# EAGLE design Dragon_LowerCase_v1 (EAGLE 7.7.0)
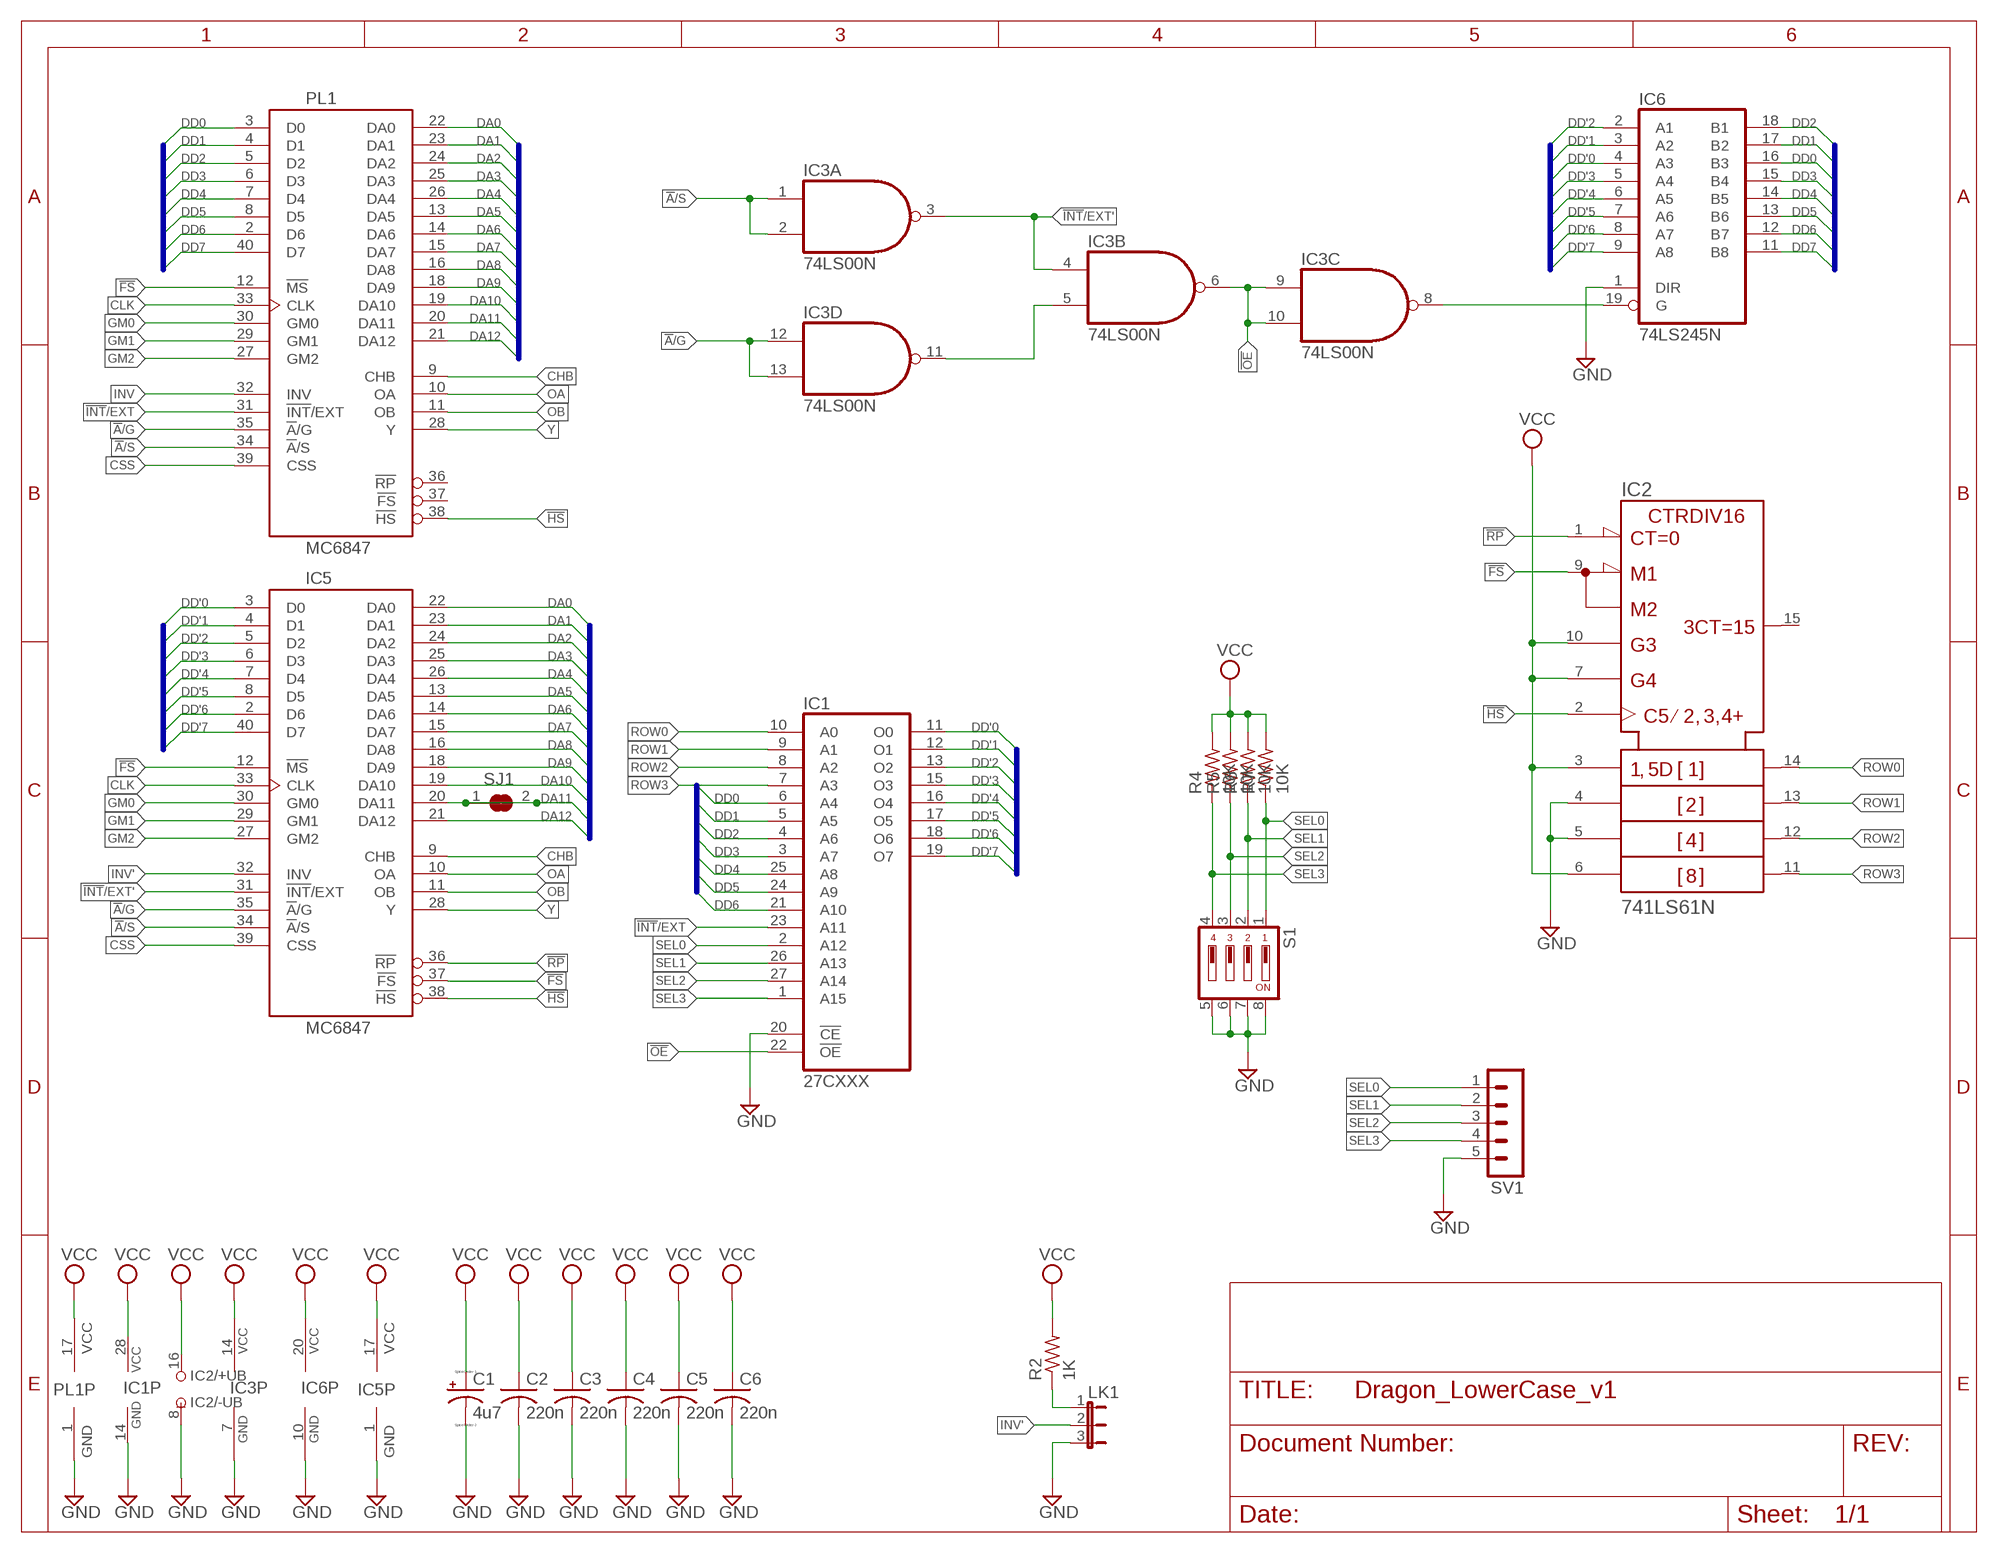
[diagram p0: schematic, sheet 1]

## Parts
C1  4u7  CPOL-USE2.5-5  [E2,5-5]
C2  220n  C-US025-025X050  [C025-025X050]
C3  220n  C-US025-025X050  [C025-025X050]
C4  220n  C-US025-025X050  [C025-025X050]
C5  220n  C-US050-025X075  [C050-025X075]
C6  220n  C-US025-025X050  [C025-025X050]
IC1  27CXXX  27512  [DIL28]
IC2  741LS61N  74161N  [DIL16]
IC3  74LS00N  [DIL14-RP]
IC5  MC6847  [DIL40]
IC6  74LS245N  [DIL20-RP]
LK1  JP2E  [JP2]
PL1  MC6847  [DIL40]
R2  1K  R-US_0204/2V  [0204V]
R4  10K  R-US_0204/2V  [0204V]
R5  10K  R-US_0204/2V  [0204V]
R6  10K  R-US_0204/2V  [0204V]
R7  10K  R-US_0204/2V  [0204V]
S1  DS04  [DS-04]
SJ1  SJ  [SJ]
SV1  MA05-1  [MA05-1]

## Nets
!A!/G: IC3.12(D:I0) IC3.13(D:I1) IC5.35(!A!/G) PL1.35(!A!/G)
!A!/S: IC3.1(A:I0) IC3.2(A:I1) IC5.34(!A!/S) PL1.34(!A!/S)
!FS: IC2.9(!LOAD) IC5.12(!MS) IC5.37(!FS) PL1.12(!MS)
!HS: IC2.2(CLK) IC5.38(!HS) PL1.38(!HS)
!INT!/EXT: IC1.23(A11) PL1.31(!INT!/EXT)
!INT!/EXT': IC3.3(A:O) IC3.4(B:I0) IC5.31(!INT!/EXT)
!OE: IC1.22(!OE) IC3.6(B:O) IC3.9(C:I0) IC3.10(C:I1)
!RP: IC2.1(!CLR) IC5.36(!RP)
CHB: IC5.9(CHB) PL1.9(CHB)
CLK: IC5.33(CLK) PL1.33(CLK)
CSS: IC5.39(CSS) PL1.39(CSS)
DA0: IC5.22(DA0) PL1.22(DA0)
DA1: IC5.23(DA1) PL1.23(DA1)
DA2: IC5.24(DA2) PL1.24(DA2)
DA3: IC5.25(DA3) PL1.25(DA3)
DA4: IC5.26(DA4) PL1.26(DA4)
DA5: IC5.13(DA5) PL1.13(DA5)
DA6: IC5.14(DA6) PL1.14(DA6)
DA7: IC5.15(DA7) PL1.15(DA7)
DA8: IC5.16(DA8) PL1.16(DA8)
DA9: IC5.18(DA9) PL1.18(DA9)
DA10: IC5.19(DA10) PL1.19(DA10)
DA11: IC5.20(DA11) PL1.20(DA11) SJ1.1 SJ1.2
DA12: IC5.21(DA12) PL1.21(DA12)
DD0: IC1.6(A4) IC6.16(B3) PL1.3(D0)
DD1: IC1.5(A5) IC6.17(B2) PL1.4(D1)
DD2: IC1.4(A6) IC6.18(B1) PL1.5(D2)
DD3: IC1.3(A7) IC6.15(B4) PL1.6(D3)
DD4: IC1.25(A8) IC6.14(B5) PL1.7(D4)
DD5: IC1.24(A9) IC6.13(B6) PL1.8(D5)
DD6: IC1.21(A10) IC6.12(B7) PL1.2(D6)
DD7: IC6.11(B8) PL1.40(D7)
DD'0: IC1.11(O0) IC5.3(D0) IC6.4(A3)
DD'1: IC1.12(O1) IC5.4(D1) IC6.3(A2)
DD'2: IC1.13(O2) IC5.5(D2) IC6.2(A1)
DD'3: IC1.15(O3) IC5.6(D3) IC6.5(A4)
DD'4: IC1.16(O4) IC5.7(D4) IC6.6(A5)
DD'5: IC1.17(O5) IC5.8(D5) IC6.7(A6)
DD'6: IC1.18(O6) IC5.2(D6) IC6.8(A7)
DD'7: IC1.19(O7) IC5.40(D7) IC6.9(A8)
GM0: IC5.30(GM0) PL1.30(GM0)
GM1: IC5.29(GM1) PL1.29(GM1)
GM2: IC5.27(GM2) PL1.27(GM2)
GND: C1.- C2.2 C3.2 C4.2 C5.2 C6.2 IC1.14(GND) IC1.20(!CE) IC2.4(B) IC2.5(C) IC2.8(-UB) IC3.7(P:GND) IC5.1(GND) IC6.1(DIR) IC6.10(GND) LK1.3 PL1.1(GND) S1.5 S1.6 S1.7 S1.8 SV1.5
INV: PL1.32(INV)
INV': IC5.32(INV) LK1.2
N$3: LK1.1 R2.1
N$5: IC3.8(C:O) IC6.19(G)
N$14: IC3.5(B:I1) IC3.11(D:O)
OA: IC5.10(OA) PL1.10(OA)
OB: IC5.11(OB) PL1.11(OB)
ROW0: IC1.10(A0) IC2.14(QA)
ROW1: IC1.9(A1) IC2.13(QB)
ROW2: IC1.8(A2) IC2.12(QC)
ROW3: IC1.7(A3) IC2.11(QD)
SEL0: IC1.2(A12) R7.1 S1.1 SV1.1
SEL1: IC1.26(A13) R6.1 S1.2 SV1.2
SEL2: IC1.27(A14) R5.1 S1.3 SV1.3
SEL3: IC1.1(A15) R4.1 S1.4 SV1.4
VCC: C1.+ C2.1 C3.1 C4.1 C5.1 C6.1 IC1.28(VCC) IC2.3(A) IC2.6(D) IC2.7(ENP) IC2.10(ENT) IC2.16(+UB) IC3.14(P:VCC) IC5.17(VCC) IC6.20(VCC) PL1.17(VCC) R2.2 R4.2 R5.2 R6.2 R7.2
Y: IC5.28(Y) PL1.28(Y)
Unconnected: IC2.15(RCO) PL1.36(!RP) PL1.37(!FS)

## Buses
DA[0..12]
DD[0..7]
DD'[0..7]

## Library data of the parts
C1 = resistor:CPOL-US: POLARIZED CAPACITOR, American symbol
C2-C6 = resistor:C-US: CAPACITOR, American symbol
IC1 = memory-rp:27512: MEMORY
IC2 = 74ttl-din-rp:74*161: Synchrounus 4-bit COUNTER
IC3 = 74xx-us-jlb:74*00: Quad 2-input NAND gate
IC5 PL1 = micro-motorola-rp:MC6847
IC6 = 74xx-us-jlb:74*245: Octal BUS TRANSCEIVER, 3-state
LK1 = jumper-jlb:JP2E: JUMPER
R2 R4-R7 = resistor:R-US_: RESISTOR, American symbol
S1 = switch-dil-rp:DS04: DIL/CODE SWITCH; OC_FARNELL: 9471570; OC_NEWARK: unknown
SJ1 = jumper-jlb:SJ: SMD solder JUMPER
SV1 = con-lstb-rp:MA05-1: PIN HEADER; OC_FARNELL: unknown; OC_NEWARK: unknown

## Board
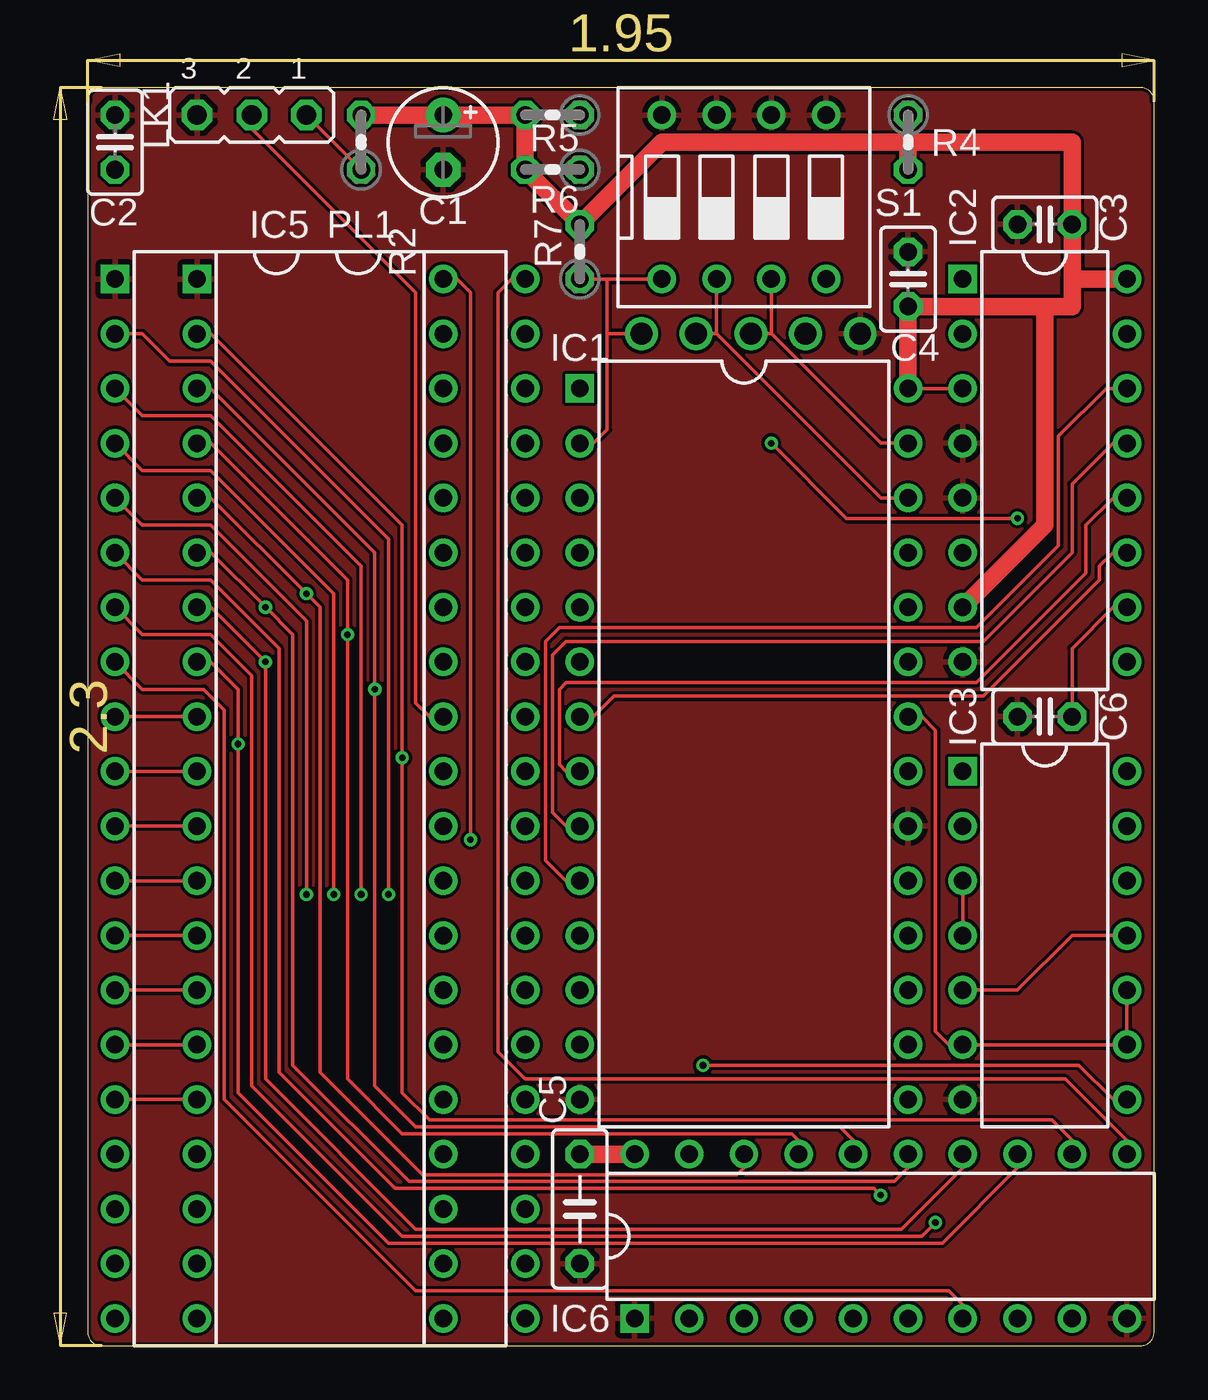
[diagram p1: board, top side]
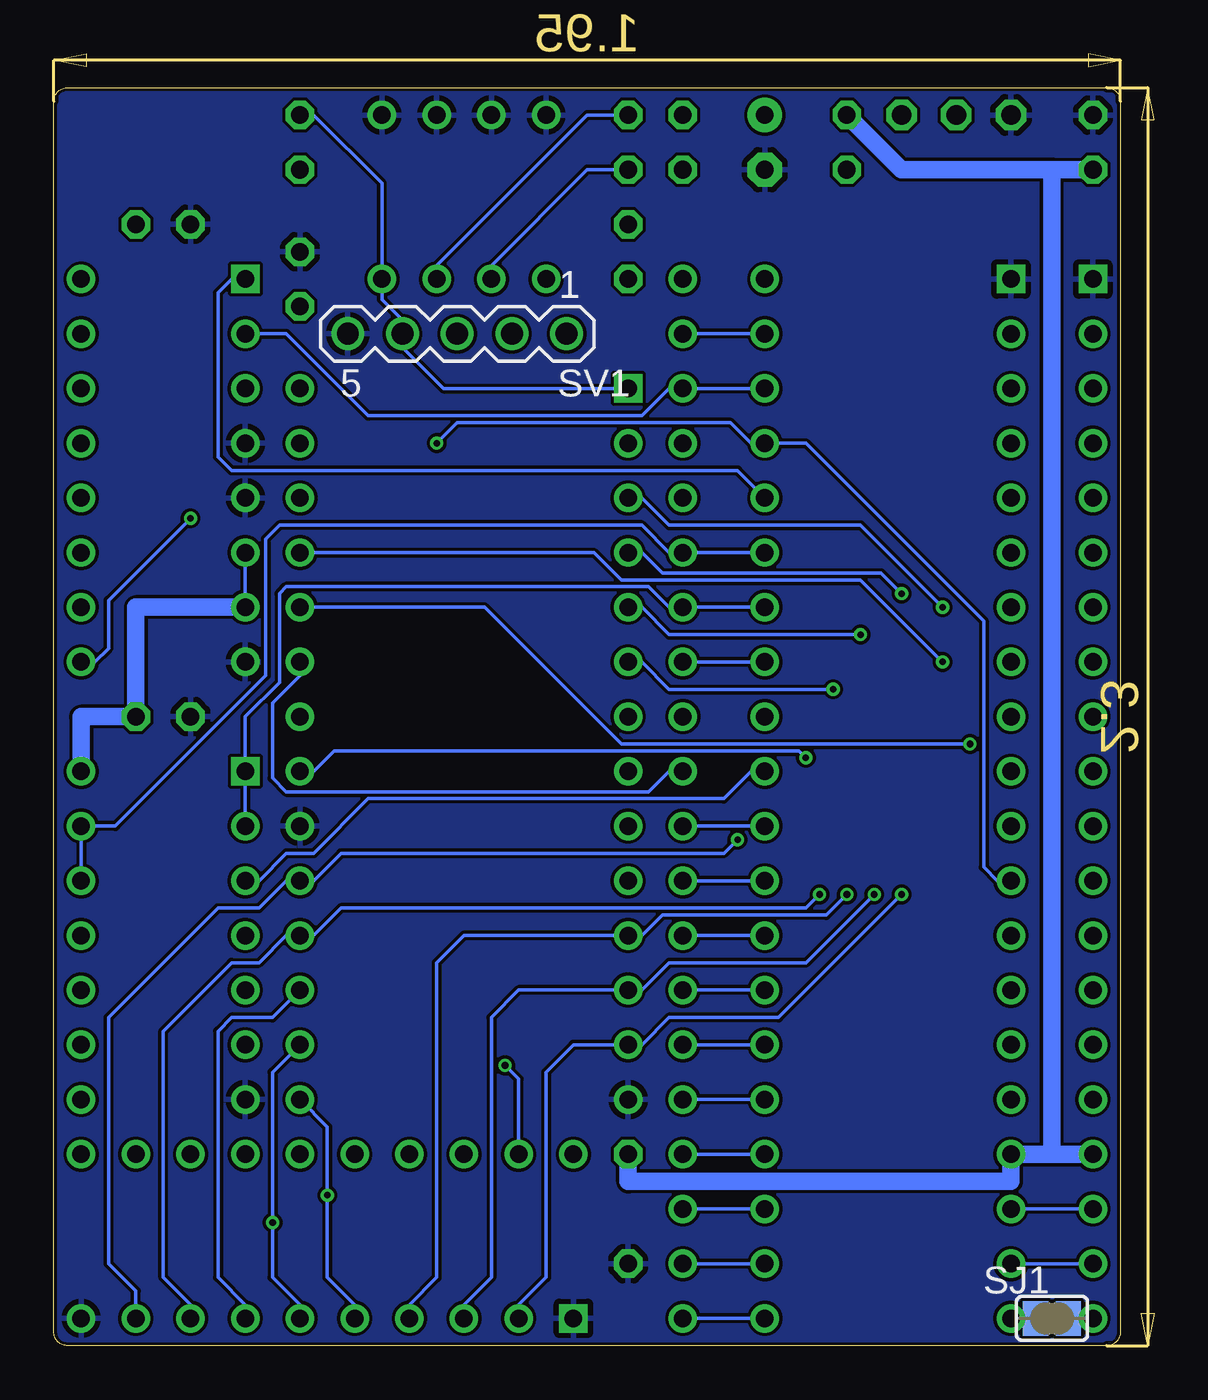
[diagram p2: board, bottom side, seen from below]

Size 49.53 x 58.42 mm. Coordinates in mm from the lower left corner, seen from the top.
Outline: 0,57.78 0,0.64 arc90 0.64,0 48.9,0 arc90 49.53,0.64 49.53,57.78 arc90 48.9,58.42 0.64,58.42 arc90 0,57.78
Copper layers (1*16): Top 0.035mm / dielectric 1.5mm / Bottom 0.035mm
Design rules "hackvana *": minimum track width 6mil, minimum drill 0.3mm, track to track 6mil, track to pad 6mil, pad to pad 6mil, via to via 6mil, smd to smd 0mil, copper to edge 6mil, drill to drill 6mil, minimum pad ring 10mil, minimum via ring 6mil, stop-mask expansion 2mil, vias tented up to drill 100mil, thermal gap 10mil

### Footprints (pad centres in the part's own frame; a part is rotated, then mirrored left to right if it is on the bottom)
E2,5-5 = drill 0.813 pad 1.6: + -1.27,0 | drill 0.813 pad 1.6 octagon: - 1.27,0
C025-025X050 = drill 0.813 octagon: 1 -1.27,0; 2 1.27,0
C050-025X075 = drill 0.813 octagon: 1 -2.54,0; 2 2.54,0
DIL28 = drill 0.813 square: 1 -16.51,-7.62 | drill 0.813: 2 -13.97,-7.62; 3 -11.43,-7.62; 4 -8.89,-7.62; 5 -6.35,-7.62; 6 -3.81,-7.62; 7 -1.27,-7.62; 8 1.27,-7.62; 9 3.81,-7.62; 10 6.35,-7.62; 11 8.89,-7.62; 12 11.43,-7.62; 13 13.97,-7.62; 14 16.51,-7.62; 15 16.51,7.62; 16 13.97,7.62; 17 11.43,7.62; 18 8.89,7.62; 19 6.35,7.62; 20 3.81,7.62; 21 1.27,7.62; 22 -1.27,7.62; 23 -3.81,7.62; 24 -6.35,7.62; 25 -8.89,7.62; 26 -11.43,7.62; 27 -13.97,7.62; 28 -16.51,7.62
DIL16 = drill 0.813 square: 1 -8.89,-3.81 | drill 0.813: 2 -6.35,-3.81; 3 -3.81,-3.81; 4 -1.27,-3.81; 5 1.27,-3.81; 6 3.81,-3.81; 7 6.35,-3.81; 8 8.89,-3.81; 9 8.89,3.81; 10 6.35,3.81; 11 3.81,3.81; 12 1.27,3.81; 13 -1.27,3.81; 14 -3.81,3.81; 15 -6.35,3.81; 16 -8.89,3.81
DIL14-RP = drill 0.813 square: 1 -7.62,-3.81 | drill 0.813: 2 -5.08,-3.81; 3 -2.54,-3.81; 4 0,-3.81; 5 2.54,-3.81; 6 5.08,-3.81; 7 7.62,-3.81; 8 7.62,3.81; 9 5.08,3.81; 10 2.54,3.81; 11 0,3.81; 12 -2.54,3.81; 13 -5.08,3.81; 14 -7.62,3.81
DIL40 = drill 0.813 square: 1 -24.13,-7.62 | drill 0.813: 2 -21.59,-7.62; 3 -19.05,-7.62; 4 -16.51,-7.62; 5 -13.97,-7.62; 6 -11.43,-7.62; 7 -8.89,-7.62; 8 -6.35,-7.62; 9 -3.81,-7.62; 10 -1.27,-7.62; 11 1.27,-7.62; 12 3.81,-7.62; 13 6.35,-7.62; 14 8.89,-7.62; 15 11.43,-7.62; 16 13.97,-7.62; 17 16.51,-7.62; 18 19.05,-7.62; 19 21.59,-7.62; 20 24.13,-7.62; 21 24.13,7.62; 22 21.59,7.62; 23 19.05,7.62; 24 16.51,7.62; 25 13.97,7.62; 26 11.43,7.62; 27 8.89,7.62; 28 6.35,7.62; 29 3.81,7.62; 30 1.27,7.62; 31 -1.27,7.62; 32 -3.81,7.62; 33 -6.35,7.62; 34 -8.89,7.62; 35 -11.43,7.62; 36 -13.97,7.62; 37 -16.51,7.62; 38 -19.05,7.62; 39 -21.59,7.62; 40 -24.13,7.62
DIL20-RP = drill 0.813 square: 1 -11.43,-3.81 | drill 0.813: 2 -8.89,-3.81; 3 -6.35,-3.81; 4 -3.81,-3.81; 5 -1.27,-3.81; 6 1.27,-3.81; 7 3.81,-3.81; 8 6.35,-3.81; 9 8.89,-3.81; 10 11.43,-3.81; 11 11.43,3.81; 12 8.89,3.81; 13 6.35,3.81; 14 3.81,3.81; 15 1.27,3.81; 16 -1.27,3.81; 17 -3.81,3.81; 18 -6.35,3.81; 19 -8.89,3.81; 20 -11.43,3.81
JP2 = drill 0.914 octagon: 1 -2.54,0; 2 0,0; 3 2.54,0
0204V = drill 0.813 octagon: 1 -1.27,0; 2 1.27,0
DS-04 = drill 0.813: 1 -3.81,-3.81; 2 -1.27,-3.81; 3 1.27,-3.81; 4 3.81,-3.81; 5 3.81,3.81; 6 1.27,3.81; 7 -1.27,3.81; 8 -3.81,3.81
SJ = smd 1.168 x 1.6: 1 -0.762,0; 2 0.762,0
MA05-1 = drill 1.016: 1 -5.08,0; 2 -2.54,0; 3 0,0; 4 2.54,0; 5 5.08,0

### Placement (x,y rotation side)
C1  16.51,55.88 270 top
C2  1.27,55.88 90 top
C3  44.45,52.07 180 top
C4  38.1,49.53 90 top
C5  22.86,6.35 270 top
C6  44.45,29.21 180 top
IC1  30.48,27.94 270 top
IC2  44.45,40.64 270 top
IC3  44.45,19.05 270 top
IC5  8.89,25.4 270 top
IC6  36.83,5.08 0 top
LK1  7.62,57.15 180 top
PL1  12.7,25.4 270 top
R2  12.7,55.88 90 top
R4  38.1,55.88 270 top
R5  21.59,57.15 180 top
R6  21.59,54.61 180 top
R7  22.86,50.8 90 top
S1  30.48,53.34 0 top
SJ1  3.17,1.27 0 bottom
SV1  30.8,46.99 180 bottom

### Tracks (layer width: path | path; a pad name or v marks a point on that pad's centre or on a via)
!A!/G
  Bottom 0.152: IC5.35 PL1.35 20.95,36.83 22.23,38.1 39.05,38.1 39.69,37.47 39.69,31.11 46.67,24.13 IC3.13 IC3.12
!A!/S
  Bottom 0.152: IC5.34 PL1.34 20.95,34.29 21.91,35.24 38.73,35.24 39.05,34.92 39.05,30.8 40.64,29.21 IC3.1 IC3.2
!FS  (via drill 0.3)
  Top 0.152: IC5.12 PL1.12 | v31.75,41.91 35.24,38.42 v43.18,38.42
  Bottom 0.152: PL1.12 5.71,21.59 6.35,22.23 6.35,33.66 14.61,41.91 IC5.37 17.14,41.91 18.1,42.86 30.8,42.86 v31.75,41.91 | IC2.9 47.62,31.75 46.99,32.38 46.99,34.61 v43.18,38.42
!HS
  Bottom 0.152: IC5.38 PL1.38 20.95,44.45 22.23,43.18 34.92,43.18 38.73,46.99 IC2.2
!INT!/EXT
  Bottom 0.152: IC1.23 38.1,31.11 39.37,29.84 39.37,26.35 38.73,25.72 21.91,25.72 20.95,26.67 PL1.31
!INT!/EXT'
  Top 0.152: IC3.3 IC3.4
  Bottom 0.152: IC5.31 17.14,26.67 18.41,25.4 34.92,25.4 37.47,22.86 38.73,22.86 40.01,21.59 IC3.3
!OE
  Top 0.152: IC1.22 38.73,29.21 39.37,28.57 39.37,14.61 40.01,13.97 IC3.6 IC3.9 IC3.10
!RP
  Bottom 0.152: IC5.36 17.78,40.64 41.27,40.64 41.91,41.27 41.91,48.9 41.27,49.53 IC2.1
CHB
  Top 0.152: PL1.9 IC5.9
CLK
  Bottom 0.152: IC5.33 PL1.33
CSS
  Bottom 0.152: IC5.39 PL1.39
DA0
  Bottom 0.152: IC5.22 PL1.22
DA1
  Bottom 0.152: IC5.23 PL1.23
DA2
  Bottom 0.152: IC5.24 PL1.24
DA3
  Bottom 0.152: IC5.25 PL1.25
DA4
  Bottom 0.152: IC5.26 PL1.26
DA5
  Top 0.152: IC5.13 PL1.13
DA6
  Top 0.152: IC5.14 PL1.14
DA7
  Top 0.152: PL1.15 IC5.15
DA8
  Top 0.152: IC5.16 PL1.16
DA9
  Bottom 0.152: IC5.18 PL1.18
DA10
  Bottom 0.152: IC5.19 PL1.19
DA11
  Bottom 0.152: IC5.20 SJ1.2 SJ1.1 PL1.20
DA12
  Bottom 0.152: IC5.21 PL1.21
DD0  (via drill 0.3)
  Top 0.152: IC6.16 35.56,9.53 34.92,10.16 15.24,10.16 13.34,12.06 v13.34,30.48 13.34,36.83 5.71,44.45 PL1.3
  Bottom 0.152: IC1.6 22.23,31.75 20.95,30.48 v13.34,30.48
DD1  (via drill 0.3)
  Top 0.152: IC6.17 33.02,9.53 32.7,9.84 14.61,9.84 12.06,12.38 v12.06,33.02 12.06,35.56 5.71,41.91 PL1.4
  Bottom 0.152: IC1.5 22.23,34.29 20.95,33.02 v12.06,33.02
DD2  (via drill 0.3)
  Top 0.152: IC6.18 30.48,8.26 30.16,7.94 15.56,7.94 10.79,12.7 10.79,34.29 v10.16,34.92 5.71,39.37 PL1.5
  Bottom 0.152: IC1.4 22.23,36.83 21.27,35.88 11.11,35.88 v10.16,34.92
DD3  (via drill 0.3)
  Top 0.152: IC6.15 38.1,8.26 37.47,7.62 14.92,7.62 9.53,13.02 9.53,33.02 v8.26,34.29 5.71,36.83 PL1.6
  Bottom 0.152: IC1.3 22.23,39.37 20.95,38.1 12.06,38.1 v8.26,34.29
DD4  (via drill 0.3)
  Top 0.152: IC6.14 40.64,8.26 37.78,5.4 15.24,5.4 8.26,12.38 v8.26,31.75 5.71,34.29 PL1.7
  Bottom 0.152: IC1.25 24.45,36.83 23.18,35.56 12.06,35.56 v8.26,31.75
DD5  (via drill 0.3)
  Top 0.152: IC6.13 43.18,8.26 39.69,4.76 13.97,4.76 6.99,11.75 v6.99,27.94 6.99,30.48 5.71,31.75 PL1.8
  Bottom 0.152: IC1.24 29.53,34.29 23.18,27.94 v6.99,27.94
DD6  (via drill 0.3)
  Top 0.152: IC6.12 45.72,9.53 44.77,10.48 15.88,10.48 14.61,11.75 v14.61,27.3 14.61,38.1 5.71,46.99 PL1.2
  Bottom 0.152: IC1.21 37.47,26.67 36.51,27.62 14.92,27.62 v14.61,27.3
DD7
  Top 0.152: IC6.11 48.26,9.53 45.4,12.38 20.32,12.38 19.05,13.65 19.05,48.9 19.68,49.53 PL1.40
DD'0  (via drill 0.3)
  Top 0.152: IC5.3 2.54,43.18 5.71,43.18 12.7,36.2 v12.7,20.95
  Bottom 0.152: IC6.4 33.02,1.91 31.75,3.17 31.75,17.78 30.48,19.05 IC1.11 22.23,19.05 21.27,20 13.65,20 v12.7,20.95
DD'1  (via drill 0.3)
  Top 0.152: IC5.4 2.54,40.64 5.71,40.64 11.43,34.92 v11.43,20.95
  Bottom 0.152: IC6.3 30.48,1.91 29.21,3.17 29.21,15.24 27.94,16.51 IC1.12 22.23,16.51 20.95,17.78 14.61,17.78 v11.43,20.95
DD'2  (via drill 0.3)
  Top 0.152: IC5.5 2.54,38.1 5.71,38.1 10.16,33.66 v10.16,20.95
  Bottom 0.152: IC6.2 27.94,1.91 26.67,3.17 26.67,12.7 25.4,13.97 IC1.13 22.23,13.97 20.95,15.24 15.88,15.24 v10.16,20.95
DD'3  (via drill 0.3)
  Top 0.152: IC5.6 2.54,35.56 5.71,35.56 8.89,32.38 8.89,12.7 14.29,7.3 36.51,7.3 v36.83,6.99
  Bottom 0.152: IC1.15 36.83,10.16 v36.83,6.99 36.83,3.17 35.56,1.91 IC6.5
DD'4  (via drill 0.3)
  Top 0.152: IC5.7 2.54,33.02 5.71,33.02 7.62,31.11 7.62,12.06 14.61,5.08 38.73,5.08 v39.37,5.71
  Bottom 0.152: IC1.16 39.37,12.7 v39.37,5.71 39.37,3.17 38.1,1.91 IC6.6
DD'5
  Top 0.152: IC5.8 2.54,30.48 5.4,30.48 6.35,29.53 6.35,11.43 15.24,2.54 40.01,2.54 40.64,1.91 IC6.7
  Bottom 0.152: IC1.17 39.37,15.24 41.27,15.24 41.91,14.61 41.91,3.17 40.64,1.91 IC6.7
DD'6  (via drill 0.3)
  Top 0.152: IC5.2 2.54,46.99 3.81,45.72 5.71,45.72 13.97,37.47 v13.97,20.95
  Bottom 0.152: IC6.8 43.18,1.91 44.45,3.17 44.45,14.61 41.27,17.78 40.01,17.78 38.73,19.05 IC1.18 37.47,19.05 36.2,20.32 14.61,20.32 v13.97,20.95
DD'7  (via drill 0.3)
  Top 0.152: IC5.40 17.14,49.53 17.78,48.9 v17.78,23.5
  Bottom 0.152: IC6.9 45.72,2.54 46.99,3.81 46.99,15.24 41.91,20.32 40.01,20.32 38.73,21.59 IC1.19 37.47,21.59 36.2,22.86 18.41,22.86 v17.78,23.5
GM0
  Bottom 0.152: IC5.30 PL1.30
GM1
  Bottom 0.152: IC5.29 PL1.29
GM2
  Bottom 0.152: IC5.27 PL1.27
GND
  pour Top: 48.9,0 0.64,0 arc-90 0,0.64 0,57.78 arc-90 0.64,58.42 48.9,58.42 arc-90 49.53,57.78 49.53,0.64 arc-90
  pour Bottom: 48.9,0 0.64,0 arc-90 0,0.64 0,57.78 arc-90 0.64,58.42 48.9,58.42 arc-90 49.53,57.78 49.53,0.64 arc-90
INV'
  Top 0.152: IC5.32 15.88,29.21 15.24,29.84 15.24,48.9 7.62,56.52 LK1.2
N$3
  Top 0.152: LK1.1 R2.1
N$5  (via drill 0.3)
  Top 0.152: IC3.8 47.62,11.43 46.04,13.02 v28.57,13.02
  Bottom 0.152: IC6.19 27.94,12.38 v28.57,13.02
N$14
  Top 0.152: IC3.5 43.18,16.51 45.72,19.05 IC3.11
OA
  Top 0.152: IC5.10 PL1.10
OB
  Top 0.152: PL1.11 IC5.11
ROW0
  Top 0.152: IC2.14 47.31,44.45 45.09,42.23 45.09,37.15 41.27,33.34 21.91,33.34 21.27,32.7 21.27,22.54 22.23,21.59 IC1.10
ROW1
  Top 0.152: IC2.13 47.62,41.91 45.72,40.01 45.72,36.83 41.59,32.7 22.23,32.7 21.59,32.07 21.59,24.77 22.23,24.13 IC1.9
ROW2
  Top 0.152: IC2.12 47.62,39.37 46.35,38.1 46.35,35.88 41.27,30.8 22.23,30.8 21.91,30.48 21.91,26.99 22.23,26.67 IC1.8
ROW3
  Top 0.152: IC2.11 47.62,36.83 46.99,36.2 46.99,35.56 41.59,30.16 24.45,30.16 23.5,29.21 IC1.7
SEL0
  Top 0.152: R7.1 24.13,49.53 | 24.13,49.53 S1.1 | IC1.2 23.5,41.91 24.13,42.55 24.13,46.99 | 24.13,46.99 24.13,49.53 | SV1.1 24.13,46.99
SEL1
  Top 0.152: S1.2 29.21,46.99 | 29.21,46.99 SV1.2 | 29.21,46.99 36.83,39.37 IC1.26
  Bottom 0.152: R6.1 24.77,54.61 29.21,50.16 S1.2
SEL2
  Top 0.152: S1.3 31.75,46.99 | 31.75,46.99 SV1.3 | 31.75,46.99 36.83,41.91 IC1.27
  Bottom 0.152: R5.1 24.77,57.15 31.75,50.16 S1.3
SEL3
  Bottom 0.152: IC1.1 31.43,44.45 33.34,46.35 SV1.4 33.34,47.62 34.29,48.58 S1.4 34.29,53.98 37.47,57.15 R4.1
VCC
  Top 0.152: IC2.10 47.62,34.29 45.72,32.38 C6.1 | IC1.28 IC2.3
  Top 0.813: R2.2 C1.+ R5.2 R6.2 R7.2 26.67,55.88 38.1,55.88 | IC1.28 C4.1 44.45,48.26 | 45.72,49.53 IC2.16 | 44.45,48.26 45.72,48.26 45.72,49.53 | IC6.20 C5.1 | 38.1,55.88 45.72,55.88 C3.1 45.72,49.53 | R4.2 38.1,55.88 | IC2.7 44.45,38.1 44.45,48.26
  Bottom 0.152: IC2.6 IC2.7
  Bottom 0.813: C5.1 22.86,7.62 5.08,7.62 PL1.17 3.17,8.89 | 3.17,8.89 3.17,54.61 | 3.17,54.61 C2.1 | 3.17,54.61 10.16,54.61 R2.2 | IC2.7 45.72,34.29 C6.1 48.26,29.21 IC3.14 | 3.17,8.89 IC5.17
Y
  Bottom 0.152: IC5.28 PL1.28

### Text on the board
tValues: INV NOR